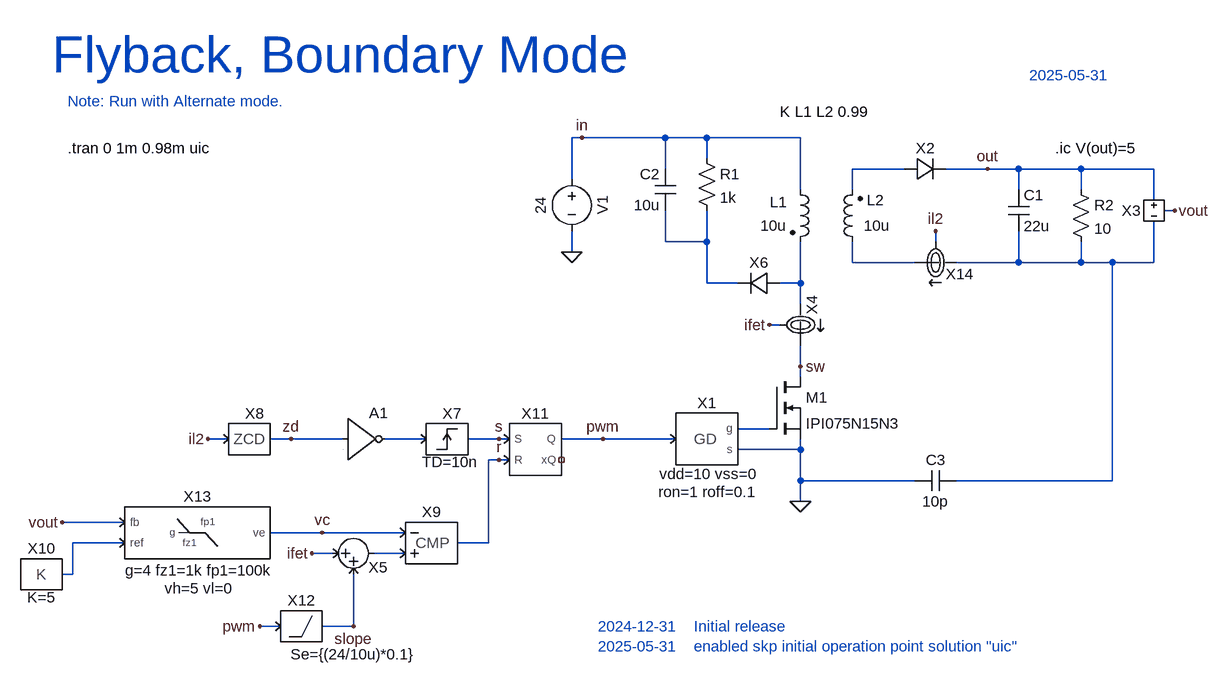
[diagram p0: schematic FLYBACK.asc]
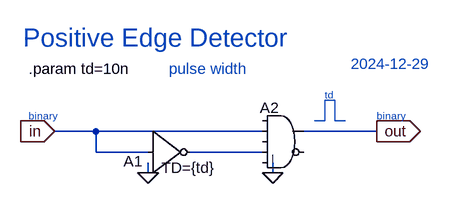
[diagram p1: sub-circuit posedge.asc]
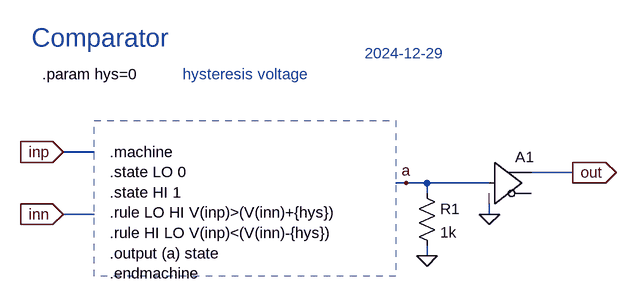
[diagram p2: sub-circuit cmp.asc]
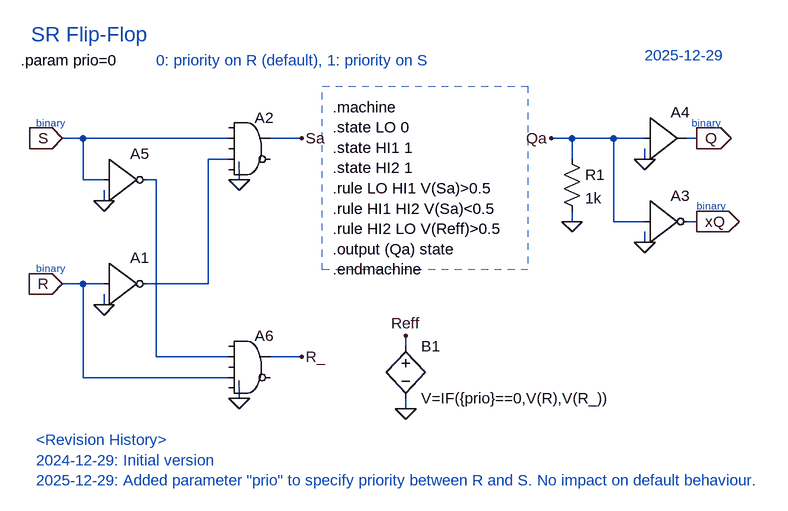
[diagram p3: sub-circuit srff.asc]
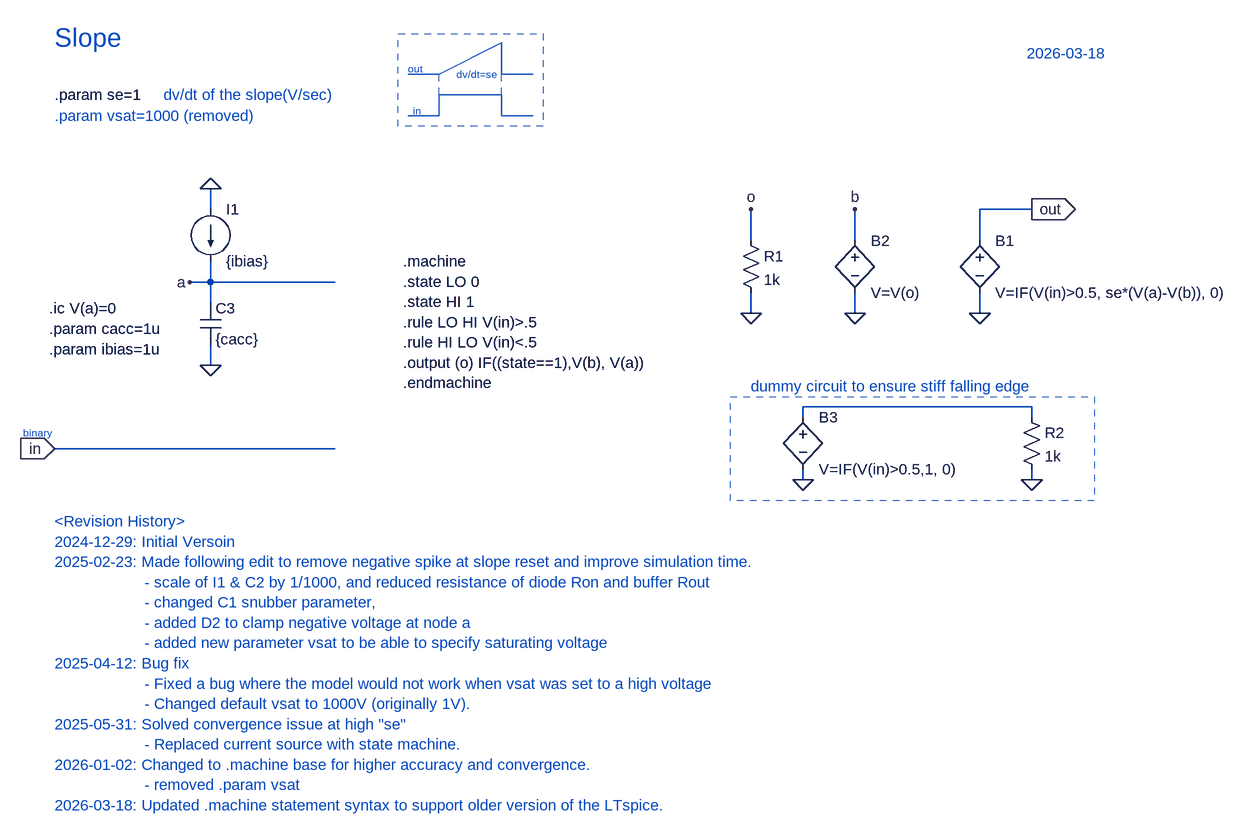
[diagram p4: sub-circuit slope.asc]
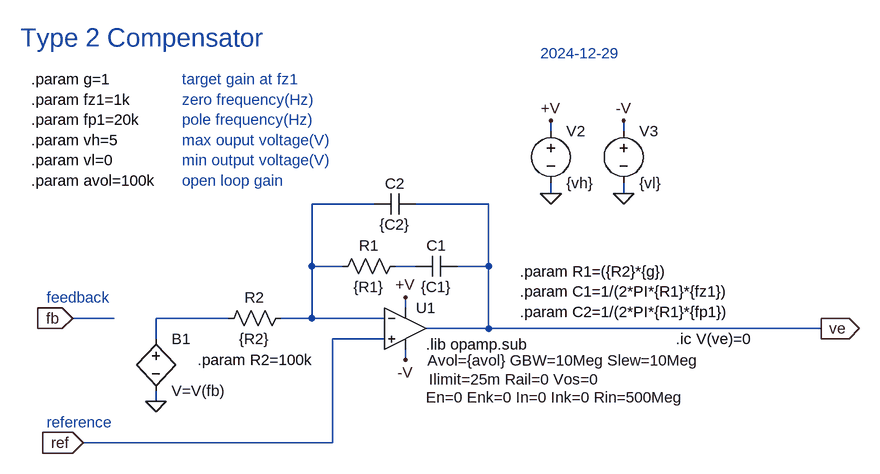
[diagram p5: sub-circuit type2.asc]
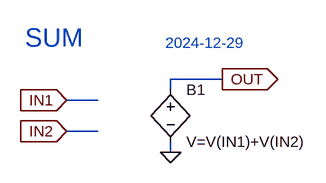
[diagram p6: sub-circuit sum.asc]
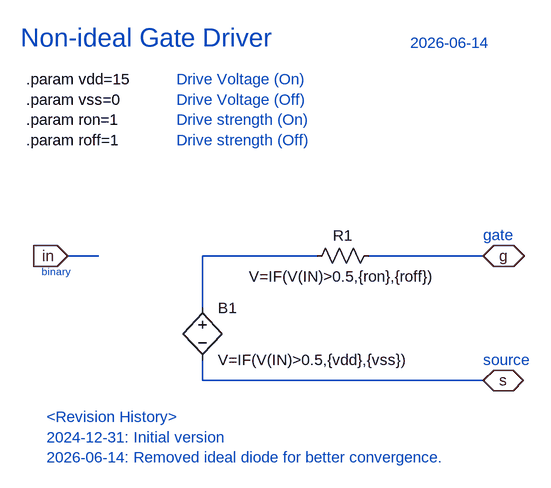
[diagram p7: sub-circuit gd.asc]
FLYBACK.asc, the LTspice schematic file:
Version 4.1
SHEET 1 1716 1312
WIRE 672 -176 656 -176
WIRE 800 -176 672 -176
WIRE 864 -176 800 -176
WIRE 1008 -176 864 -176
WIRE 864 -144 864 -176
WIRE 800 -128 800 -176
WIRE 1168 -128 1088 -128
WIRE 1296 -128 1232 -128
WIRE 1344 -128 1296 -128
WIRE 1440 -128 1344 -128
WIRE 1552 -128 1440 -128
WIRE 656 -112 656 -176
WIRE 1008 -96 1008 -176
WIRE 1088 -96 1088 -128
WIRE 1344 -96 1344 -128
WIRE 1440 -96 1440 -128
WIRE 1552 -80 1552 -128
WIRE 1584 -64 1568 -64
WIRE 800 -16 800 -64
WIRE 864 -16 864 -64
WIRE 864 -16 800 -16
WIRE 1216 -16 1216 -32
WIRE 656 0 656 -32
WIRE 1088 16 1088 -16
WIRE 1184 16 1088 16
WIRE 1344 16 1344 -32
WIRE 1344 16 1248 16
WIRE 1440 16 1440 -16
WIRE 1440 16 1344 16
WIRE 1488 16 1440 16
WIRE 1552 16 1552 -48
WIRE 1552 16 1488 16
WIRE 864 48 864 -16
WIRE 912 48 864 48
WIRE 1008 48 1008 -16
WIRE 1008 48 976 48
WIRE 1008 80 1008 48
WIRE 976 112 960 112
WIRE 1008 176 1008 144
WIRE 1008 192 1008 176
WIRE 960 272 912 272
WIRE 128 288 96 288
WIRE 224 288 192 288
WIRE 304 288 224 288
WIRE 432 288 368 288
WIRE 544 288 496 288
WIRE 560 288 544 288
WIRE 704 288 640 288
WIRE 816 288 704 288
WIRE 1008 304 1008 288
WIRE 1008 304 912 304
WIRE 544 320 528 320
WIRE 560 320 544 320
WIRE 1008 352 1008 304
WIRE 1184 352 1008 352
WIRE 1488 352 1488 16
WIRE 1488 352 1248 352
WIRE 1008 384 1008 352
WIRE -32 416 -128 416
WIRE 272 432 192 432
WIRE 400 432 272 432
WIRE -32 448 -112 448
WIRE 528 448 528 320
WIRE 528 448 480 448
WIRE 288 464 256 464
WIRE 400 464 352 464
WIRE -112 496 -112 448
WIRE -112 496 -128 496
WIRE 208 576 176 576
WIRE 320 576 320 496
WIRE 320 576 272 576
FLAG 656 0 0
FLAG 1008 176 sw
FLAG 272 432 vc
FLAG 704 288 pwm
FLAG 544 288 s
FLAG 544 320 r
FLAG 176 576 pwm
FLAG 320 576 slope
FLAG 672 -176 in
FLAG 1008 384 0
FLAG 960 112 ifet
FLAG 1296 -128 out
FLAG 1584 -64 vout
FLAG -128 416 vout
FLAG 256 464 ifet
FLAG 1216 -32 il2
FLAG 96 288 il2
FLAG 224 288 zd
SYMBOL voltage 656 -128 R0
WINDOW 0 32 56 VTop 2
WINDOW 3 -32 56 VBottom 2
WINDOW 123 0 0 Left 0
WINDOW 39 0 0 Left 0
SYMATTR InstName V1
SYMATTR Value 24
SYMBOL ind2 992 -112 R0
WINDOW 0 -31 35 Left 2
WINDOW 3 -46 71 Left 2
SYMATTR InstName L1
SYMATTR Value 10u
SYMATTR SpiceLine Rser=10m
SYMATTR Type ind
SYMBOL IMON 1008 112 R90
SYMATTR InstName X4
SYMBOL POSEDGE 464 288 R0
WINDOW 39 5 51 Bottom 2
SYMATTR SpiceLine TD=10n
SYMATTR InstName X7
SYMBOL CMP 448 448 R0
SYMATTR InstName X9
SYMBOL SRFF 592 304 R0
SYMATTR InstName X11
SYMBOL SLOPE 240 576 R0
WINDOW 39 80 59 Bottom 2
SYMATTR SpiceLine Se={(24/10u)*0.1}
SYMATTR InstName X12
SYMBOL TYPE2 80 432 R0
WINDOW 0 0 -56 Center 2
WINDOW 39 2 58 Center 2
WINDOW 40 2 86 Center 2
SYMATTR InstName X13
SYMATTR SpiceLine g=4 fz1=1k fp1=100k
SYMBOL CONST -160 496 R0
WINDOW 39 0 51 Bottom 2
SYMATTR SpiceLine K=5
SYMATTR InstName X10
SYMBOL SUM 320 464 R0
WINDOW 0 38 37 Bottom 2
SYMATTR InstName X5
SYMBOL PowerSim\\GD 864 288 R0
WINDOW 39 2 69 Bottom 2
WINDOW 40 2 97 Bottom 2
SYMATTR SpiceLine vdd=10 vss=0
SYMATTR SpiceLine2 ron=1 roff=0.1
SYMATTR InstName X1
SYMBOL nmos 960 192 R0
SYMATTR InstName M1
SYMATTR Value IPI075N15N3
SYMBOL res 848 -160 R0
SYMATTR InstName R1
SYMATTR Value 1k
SYMBOL ind2 1104 0 R180
WINDOW 0 -33 80 Left 2
WINDOW 3 -42 41 Left 2
SYMATTR InstName L2
SYMATTR Value 10u
SYMATTR SpiceLine Rser=10m
SYMATTR Type ind
SYMBOL PowerSim\\iD 1200 -128 R270
WINDOW 0 16 0 VTop 2
SYMATTR InstName X2
SYMBOL cap 1328 -96 R0
SYMATTR InstName C1
SYMATTR Value 22u
SYMATTR SpiceLine Rser=1m
SYMBOL res 1424 -112 R0
SYMATTR InstName R2
SYMATTR Value 10
SYMBOL PowerSim\\VMON 1552 -64 R0
SYMATTR InstName X3
SYMBOL cap 816 -128 M0
SYMATTR InstName C2
SYMATTR Value 10u
SYMATTR SpiceLine Rser=1m
SYMBOL IMON 1216 16 R180
SYMATTR InstName X14
SYMBOL PowerSim\\ZCD 160 288 R0
SYMATTR InstName X8
SYMBOL Digital\\inv 304 224 R0
SYMATTR InstName A1
SYMBOL cap 1248 336 R90
WINDOW 0 0 32 VBottom 2
WINDOW 3 32 32 VTop 2
SYMATTR InstName C3
SYMATTR Value 10p
SYMBOL PowerSim\\iD 944 48 R90
WINDOW 0 -16 0 VBottom 2
SYMATTR InstName X6
TEXT -120 -160 Left 2 !.tran 0 1m 0.98m uic
TEXT -144 -304 Left 6 ;Flyback, Boundary Mode
TEXT 1360 -272 Left 2 ;2025-05-31
TEXT 976 -216 Left 2 !K L1 L2 0.99
TEXT 1400 -160 Left 2 !.ic V(out)=5
TEXT -120 -232 Left 2 ;Note: Run with Alternate mode.
TEXT 696 576 Left 2 ;2024-12-31    Initial release\n2025-05-31    enabled skp initial operation point solution "uic"

posedge.asc, the sub-circuit schematic file:
Version 4
SHEET 1 880 680
WIRE 192 160 128 160
WIRE 448 160 192 160
WIRE 624 160 512 160
WIRE 192 192 192 160
WIRE 272 192 192 192
WIRE 448 192 336 192
WIRE 272 224 272 208
WIRE 464 224 464 208
FLAG 128 160 in
IOPIN 128 160 In
FLAG 464 224 0
FLAG 624 160 out
IOPIN 624 160 Out
FLAG 272 224 0
SYMBOL Digital\\and 480 112 R0
WINDOW 0 -36 12 Left 2
SYMATTR InstName A2
SYMBOL Digital\\inv 272 128 R0
WINDOW 3 21 88 Left 2
WINDOW 0 -38 78 Left 2
SYMATTR Value TD={td}
SYMATTR InstName A1
TEXT 88 64 Left 2 !.param td=10n
TEXT 80 16 Left 4 ;Positive Edge Detector
TEXT 88 136 Left 1 ;binary
TEXT 624 136 Left 1 ;binary
TEXT 544 104 Left 1 ;td
TEXT 304 64 Left 2 ;pulse width
TEXT 584 56 Left 2 ;2024-12-29
LINE Normal 544 144 528 144
LINE Normal 544 144 544 112
LINE Normal 560 144 560 112
LINE Normal 576 144 560 144
LINE Normal 544 112 560 112

cmp.asc, the sub-circuit schematic file:
Version 4
SHEET 1 1276 680
WIRE 352 96 304 96
WIRE 1088 128 1024 128
WIRE 832 144 816 144
WIRE 864 144 832 144
WIRE 960 144 864 144
WIRE 864 160 864 144
WIRE 352 192 304 192
WIRE 960 192 960 176
WIRE 864 256 864 240
FLAG 304 96 inp
IOPIN 304 96 In
FLAG 304 192 inn
IOPIN 304 192 In
FLAG 1088 128 out
IOPIN 1088 128 Out
FLAG 864 256 0
FLAG 832 144 a
FLAG 960 192 0
SYMBOL res 848 144 R0
SYMATTR InstName R1
SYMATTR Value 1k
SYMBOL Digital\\buf 960 80 R0
SYMATTR InstName A1
TEXT 376 96 Left 2 !.machine\n.state LO 0\n.state HI 1\n.rule LO HI V(inp)>(V(inn)+{hys})\n.rule HI LO V(inp)<(V(inn)-{hys})\n.output (a) state\n.endmachine
TEXT 272 -24 Left 2 !.param hys=0
TEXT 256 -80 Left 4 ;Comparator
TEXT 488 -24 Left 2 ;hysteresis voltage
TEXT 768 -56 Left 2 ;2024-12-29
RECTANGLE Normal 816 288 352 48 2

srff.asc, the sub-circuit schematic file:
Version 4.1
SHEET 1 928 680
WIRE -272 -496 -304 -496
WIRE -48 -496 -272 -496
WIRE 64 -496 16 -496
WIRE 480 -496 448 -496
WIRE 544 -496 480 -496
WIRE 592 -496 544 -496
WIRE 672 -496 656 -496
WIRE -48 -464 -80 -464
WIRE 480 -464 480 -496
WIRE 592 -464 592 -480
WIRE -272 -432 -272 -496
WIRE -240 -432 -272 -432
WIRE -160 -432 -176 -432
WIRE -32 -432 -32 -448
WIRE -240 -400 -240 -416
WIRE 480 -368 480 -384
WIRE 544 -368 544 -496
WIRE 592 -368 544 -368
WIRE 672 -368 656 -368
WIRE 592 -336 592 -352
WIRE -272 -272 -304 -272
WIRE -240 -272 -272 -272
WIRE -80 -272 -80 -464
WIRE -80 -272 -176 -272
WIRE -240 -240 -240 -256
WIRE 224 -176 224 -192
WIRE -160 -160 -160 -432
WIRE -48 -160 -160 -160
WIRE 64 -160 16 -160
WIRE -272 -128 -272 -272
WIRE -48 -128 -272 -128
WIRE -32 -96 -32 -112
WIRE 224 -80 224 -96
FLAG -304 -496 S
IOPIN -304 -496 In
FLAG -304 -272 R
IOPIN -304 -272 In
FLAG -240 -240 0
FLAG -32 -432 0
FLAG 64 -496 Sa
FLAG 592 -336 0
FLAG 672 -496 Q
IOPIN 672 -496 Out
FLAG 672 -368 xQ
IOPIN 672 -368 Out
FLAG 592 -464 0
FLAG 448 -496 Qa
FLAG 480 -368 0
FLAG 224 -80 0
FLAG 224 -192 Reff
FLAG -240 -400 0
FLAG -32 -96 0
FLAG 64 -160 R_
SYMBOL Digital\\inv -240 -336 R0
SYMATTR InstName A1
SYMBOL Digital\\and -16 -544 R0
SYMATTR InstName A2
SYMBOL Digital\\inv 592 -432 R0
SYMATTR InstName A3
SYMBOL Digital\\buf1 592 -560 R0
SYMATTR InstName A4
SYMBOL res 464 -480 R0
SYMATTR InstName R1
SYMATTR Value 1k
SYMBOL bv 224 -192 R0
SYMATTR InstName B1
SYMATTR Value V=IF({prio}==0,V(R),V(R_))
SYMBOL Digital\\inv -240 -496 R0
SYMATTR InstName A5
SYMBOL Digital\\and -16 -208 R0
SYMATTR InstName A6
TEXT 112 -544 Left 2 !.machine\n.state LO 0\n.state HI1 1\n.state HI2 1\n.rule LO HI1 V(Sa)>0.5\n.rule HI1 HI2 V(Sa)<0.5\n.rule HI2 LO V(Reff)>0.5\n.output (Qa) state\n.endmachine
TEXT -352 -656 Left 3 ;SR Flip-Flop
TEXT -344 -520 Left 1 ;binary
TEXT -344 -296 Left 1 ;binary
TEXT 664 -520 Left 1 ;binary
TEXT 672 -392 Left 1 ;binary
TEXT 592 -624 Left 2 ;2025-12-29
TEXT -368 -616 Left 2 !.param prio=0
TEXT -160 -616 Left 2 ;0: priority on R (default), 1: priority on S
TEXT -344 -32 Left 2 ;<Revision History>\n2024-12-29: Initial version\n2025-12-29: Added parameter "prio" to specify priority between R and S. No impact on default behaviour.
RECTANGLE Normal 412 -294 96 -576 2

slope.asc, the sub-circuit schematic file:
Version 4.1
SHEET 1 2080 1228
WIRE -64 288 -64 256
WIRE 1200 288 1120 288
WIRE 768 336 768 288
WIRE 928 336 928 288
WIRE 1120 336 1120 288
WIRE -64 400 -64 368
WIRE -64 400 -96 400
WIRE 128 400 -64 400
WIRE -64 432 -64 400
WIRE 768 448 768 416
WIRE 928 448 928 416
WIRE 1120 448 1120 416
WIRE -64 528 -64 496
WIRE 1200 592 848 592
WIRE 848 608 848 592
WIRE 1200 608 1200 592
WIRE 128 656 -304 656
WIRE 848 704 848 688
WIRE 1200 704 1200 688
FLAG -304 656 in
IOPIN -304 656 In
FLAG -64 256 0
FLAG -64 528 0
FLAG 1200 288 out
IOPIN 1200 288 Out
FLAG -96 400 a
FLAG 1120 448 0
FLAG 768 448 0
FLAG 768 288 o
FLAG 928 448 0
FLAG 928 288 b
FLAG 1200 704 0
FLAG 848 704 0
SYMBOL current -64 288 R0
SYMATTR InstName I1
SYMATTR Value {ibias}
SYMBOL cap -80 432 R0
SYMATTR InstName C3
SYMATTR Value {cacc}
SYMBOL bv 1120 320 R0
SYMATTR InstName B1
SYMATTR Value V=IF(V(in)>0.5, se*(V(a)-V(b)), 0)
SYMBOL res 752 320 R0
SYMATTR InstName R1
SYMATTR Value 1k
SYMBOL bv 928 320 R0
SYMATTR InstName B2
SYMATTR Value V=V(o)
SYMBOL bv 848 592 R0
SYMATTR InstName B3
SYMATTR Value V=IF(V(in)>0.5,1, 0)
SYMBOL res 1184 592 R0
SYMATTR InstName R2
SYMATTR Value 1k
TEXT -304 112 Left 2 !.param se=1
TEXT -304 24 Left 4 ;Slope
TEXT -352 632 Left 1 ;binary
TEXT -136 112 Left 2 ;dv/dt of the slope(V/sec)
TEXT 248 136 Left 1 ;in
TEXT 240 72 Left 1 ;out
TEXT 376 80 Right 1 ;dv/dt=se
TEXT 1192 48 Left 2 ;2026-03-18
TEXT -304 768 Left 2 ;<Revision History>\n2024-12-29: Initial Versoin\n2025-02-23: Made following edit to remove negative spike at slope reset and improve simulation time.\n                    - scale of I1 & C2 by 1/1000, and reduced resistance of diode Ron and buffer Rout\n                    - changed C1 snubber parameter, \n                    - added D2 to clamp negative voltage at node a \n                    - added new parameter vsat to be able to specify saturating voltage\n2025-04-12: Bug fix \n                    - Fixed a bug where the model would not work when vsat was set to a high voltage \n                    - Changed default vsat to 1000V (originally 1V).\n2025-05-31: Solved convergence issue at high "se" \n                    - Replaced current source with state machine.\n2026-01-02: Changed to .machine base for higher accuracy and convergence.\n                    - removed .param vsat\n2026-03-18: Updated .machine statement syntax to support older version of the LTspice.
TEXT -304 144 Left 2 ;.param vsat=1000 (removed)
TEXT -312 472 Left 2 !.param cacc=1u\n.param ibias=1u
TEXT -312 440 Left 2 !.ic V(a)=0
TEXT 232 368 Left 2 !.machine\n.state LO 0\n.state HI 1\n.rule LO HI V(in)>.5\n.rule HI LO V(in)<.5\n.output (o) IF((state==1),V(b), V(a))\n.endmachine
TEXT 768 560 Left 2 ;dummy circuit to ensure stiff falling edge
LINE Normal 288 144 240 144
LINE Normal 288 144 288 112
LINE Normal 384 112 288 112
LINE Normal 384 144 384 112
LINE Normal 432 144 384 144
LINE Normal 288 80 240 80
LINE Normal 288 80 384 32
LINE Normal 384 80 384 32
LINE Normal 432 80 384 80
LINE Normal 288 112 288 80 1
LINE Normal 384 112 384 80 1
RECTANGLE Normal 448 160 225 18 2
RECTANGLE Normal 1296 736 736 576 2

type2.asc, the sub-circuit schematic file:
Version 4
SHEET 1 1008 680
WIRE 464 -144 464 -160
WIRE 576 -144 576 -160
WIRE 464 -48 464 -64
WIRE 576 -48 576 -64
WIRE 192 -32 96 -32
WIRE 368 -32 256 -32
WIRE 96 64 96 -32
WIRE 144 64 96 64
WIRE 256 64 224 64
WIRE 368 64 368 -32
WIRE 368 64 320 64
WIRE 240 128 240 112
WIRE -208 144 -272 144
WIRE -32 144 -144 144
WIRE 96 144 96 64
WIRE 96 144 48 144
WIRE 208 144 96 144
WIRE 368 160 368 64
WIRE 368 160 272 160
WIRE 880 160 368 160
WIRE -144 176 -144 144
WIRE 208 176 128 176
WIRE 240 208 240 192
WIRE -144 272 -144 256
WIRE 128 336 128 176
WIRE 128 336 -256 336
FLAG -272 144 fb
IOPIN -272 144 In
FLAG -256 336 ref
IOPIN -256 336 In
FLAG -144 272 0
FLAG 880 160 ve
IOPIN 880 160 Out
FLAG 576 -48 0
FLAG 464 -48 0
FLAG 464 -160 +V
FLAG 576 -160 -V
FLAG 240 112 +V
FLAG 240 208 -V
SYMBOL res 240 48 R90
WINDOW 0 0 56 VBottom 2
WINDOW 3 32 56 VTop 2
SYMATTR InstName R1
SYMATTR Value {R1}
SYMBOL cap 320 48 R90
WINDOW 0 0 32 VBottom 2
WINDOW 3 32 32 VTop 2
SYMATTR InstName C1
SYMATTR Value {C1}
SYMBOL cap 256 -48 R90
WINDOW 0 0 32 VBottom 2
WINDOW 3 32 32 VTop 2
SYMATTR InstName C2
SYMATTR Value {C2}
SYMBOL bv -144 160 R0
SYMATTR InstName B1
SYMATTR Value V=V(fb)
SYMBOL res 64 128 R90
WINDOW 0 0 56 VBottom 2
WINDOW 3 32 56 VTop 2
SYMATTR InstName R2
SYMATTR Value {R2}
SYMBOL UniversalOpAmp2 240 160 R0
WINDOW 123 34 49 Left 2
WINDOW 39 36 78 Left 2
WINDOW 40 32 106 Left 2
SYMATTR Value2 Avol={avol} GBW=10Meg Slew=10Meg
SYMATTR InstName U1
SYMBOL voltage 464 -160 R0
SYMATTR InstName V2
SYMATTR Value {vh}
SYMBOL voltage 576 -160 R0
SYMATTR InstName V3
SYMATTR Value {vl}
TEXT 272 184 Left 2 !.lib opamp.sub
TEXT -336 -224 Left 2 !.param g=1\n.param fz1=1k\n.param fp1=20k\n.param vh=5\n.param vl=0\n.param avol=100k
TEXT 416 72 Left 2 !.param R1=({R2}*{g})\n.param C1=1/(2*PI*{R1}*{fz1})\n.param C2=1/(2*PI*{R1}*{fp1})
TEXT -352 -288 Left 4 ;Type 2 Compensator
TEXT -80 208 Left 2 !.param R2=100k
TEXT -104 -224 Left 2 ;target gain at fz1\nzero frequency(Hz)\npole frequency(Hz)\nmax ouput voltage(V)\nmin output voltage(V)\nopen loop gain
TEXT -312 112 Left 2 ;feedback
TEXT -312 304 Left 2 ;reference
TEXT 656 176 Left 2 !.ic V(ve)=0
TEXT 448 -264 Left 2 ;2024-12-29

sum.asc, the sub-circuit schematic file:
Version 4
SHEET 1 880 680
WIRE 288 96 208 96
WIRE 208 112 208 96
WIRE 96 128 48 128
WIRE 96 176 48 176
WIRE 208 208 208 192
FLAG 48 128 IN1
IOPIN 48 128 In
FLAG 48 176 IN2
IOPIN 48 176 In
FLAG 208 208 0
FLAG 288 96 OUT
IOPIN 288 96 Out
SYMBOL bv 208 96 R0
SYMATTR InstName B1
SYMATTR Value V=V(IN1)+V(IN2)
TEXT -16 32 Left 4 ;SUM
TEXT 200 40 Left 2 ;2024-12-29

gd.asc, the sub-circuit schematic file:
Version 4.1
SHEET 1 1232 680
WIRE 64 48 16 48
WIRE 400 48 224 48
WIRE 656 48 480 48
WIRE 224 128 224 48
WIRE 224 240 224 208
WIRE 656 240 224 240
FLAG 16 48 in
IOPIN 16 48 In
FLAG 656 48 g
IOPIN 656 48 BiDir
FLAG 656 240 s
IOPIN 656 240 BiDir
SYMBOL bv 224 112 R0
SYMATTR InstName B1
SYMATTR Value V=IF(V(IN)>0.5,{vdd},{vss})
SYMBOL res 496 32 R90
WINDOW 0 0 56 VBottom 2
WINDOW 3 32 56 VTop 2
SYMATTR InstName R1
SYMATTR Value V=IF(V(IN)>0.5,{ron},{roff})
TEXT -48 -224 Left 2 !.param vdd=15\n.param vss=0\n.param ron=1\n.param roff=1
TEXT -56 -288 Left 4 ;Non-ideal Gate Driver
TEXT 184 -224 Left 2 ;Drive Voltage (On)\nDrive Voltage (Off)\nDrive strength (On)\nDrive strength (Off)
TEXT -24 72 Left 1 ;binary
TEXT 656 16 Left 2 ;gate
TEXT 656 208 Left 2 ;source
TEXT 544 -280 Left 2 ;2026-06-14
TEXT -16 296 Left 2 ;<Revision History>\n2024-12-31: Initial version\n2026-06-14: Removed ideal diode for better convergence.

vmon.asc, the sub-circuit schematic file:
Version 4
SHEET 1 880 680
WIRE 176 -32 80 -32
WIRE -112 0 -112 -32
WIRE 80 0 80 -32
WIRE -112 96 -112 80
WIRE 80 112 80 80
FLAG -112 -32 p
IOPIN -112 -32 BiDir
FLAG -112 96 n
IOPIN -112 96 BiDir
FLAG 176 -32 out
IOPIN 176 -32 Out
FLAG 80 112 0
SYMBOL bv 80 -16 R0
SYMATTR InstName B1
SYMATTR Value V=V(p)-V(n)
SYMBOL current -112 0 R0
WINDOW 123 0 0 Left 0
WINDOW 39 0 0 Left 0
SYMATTR InstName I1
SYMATTR Value 0
TEXT -144 -160 Left 4 ;Voltage Monitor
TEXT -88 -56 Left 2 ;positive
TEXT -88 120 Left 2 ;negative
TEXT 192 -112 Left 2 ;2024-12-29

zcd.asc, the sub-circuit schematic file:
Version 4.1
SHEET 1 952 680
WIRE -32 384 -80 384
WIRE 752 384 640 384
WIRE 448 400 432 400
WIRE 480 400 448 400
WIRE 576 400 480 400
WIRE 480 416 480 400
WIRE 576 448 576 432
WIRE 480 512 480 496
FLAG -80 384 in
IOPIN -80 384 In
FLAG 752 384 zcd
IOPIN 752 384 Out
FLAG 480 512 0
FLAG 448 400 a
FLAG 576 448 0
SYMBOL res 464 400 R0
SYMATTR InstName R1
SYMATTR Value 1k
SYMBOL Digital\\buf 576 336 R0
SYMATTR InstName A1
TEXT 16 -8 Left 4 ;Zero Cross Detector
TEXT 752 360 Left 1 ;binary
TEXT 752 408 Left 1 ;1: input positive\n0: input negative
TEXT 720 8 Left 2 ;2025-07-21
TEXT -8 352 Left 2 !.machine\n.state LO 0\n.state HI 1\n.rule LO HI V(in)>{hys}\n.rule HI LO V(in)<-{hys}\n.output (a) state\n.endmachine
TEXT 24 40 Left 2 !.param hys=0
TEXT 240 40 Left 2 ;hysteresis voltage
TEXT -80 600 Left 2 ;<Revision History>\n2024-12-29: Initial version\n2025-07-21: Changed to .machine and added hysteresis.
RECTANGLE Normal 432 544 -32 304 2

The netlist it stands for:
* FLYBACK.asc
V1 in 0 24
L1 in N005 10u Rser=10m
X§X4 sw ifet N005 IMON rsns=10u  ; pins n out p
X§X7 N007 s posedge params: TD=10n
X§X9 vc N009 r cmp params: hys=0
X§X11 r s pwm NC_01 srff params: prio=0
X§X12 pwm slope slope params: Se={(24/10u)*0.1}
X§X13 vout N008 vc type2 params: avol=100k g=4 fz1=1k fp1=100k vh=5 vl=0
X§X10 N008 CONST K=5  ; pins K
X§X5 ifet slope N009 sum
X§X1 pwm N006 0 gd params: vdd=10 vss=0 ron=1 roff=0.1
M1 sw N006 0 0 IPI075N15N3
R1 in N002 1k
L2 N003 N001 10u Rser=10m
X§X2 N001 out iD params: von=1n ron=10m esl=1f rsnb=1k csnb=10p  ; pins AN CA
C1 out N004 22u Rser=1m
R2 out N004 10
X§X3 N004 vout out vmon
C2 in N002 10u Rser=1m
X§X14 N003 il2 N004 IMON rsns=10u  ; pins n out p
X§X8 il2 zd zcd params: hys=0
A1 zd 0 0 0 0 N007 0 0 BUF
C3 N004 0 10p
X§X6 N005 N002 iD params: von=1n ron=10m esl=1f rsnb=1k csnb=10p  ; pins AN CA

* block symbol definitions
.subckt posedge in out
A2 0 in 0 N001 0 0 out 0 AND
A1 in 0 0 0 0 N001 0 0 BUF TD={td}
.param td=10n
* Positive Edge Detector
* binary
* binary
* td
* pulse width
* 2024-12-29
.ends posedge

.subckt cmp inn inp out
R1 a 0 1k
A1 a 0 0 0 0 0 out 0 BUF
.machine
.state LO 0
.state HI 1
.rule LO HI V(inp)>(V(inn)+{hys})
.rule HI LO V(inp)<(V(inn)-{hys})
.output (a) state
.endmachine
.param hys=0
* Comparator
* hysteresis voltage
* 2024-12-29
.ends cmp

.subckt srff R S Q xQ
A1 R 0 0 0 0 N001 0 0 BUF
A2 0 S 0 N001 0 0 Sa 0 AND
A3 Qa 0 0 0 0 xQ 0 0 BUF
A4 Qa 0 0 0 0 0 Q 0 BUF
R1 Qa 0 1k
B1 Reff 0 V=IF({prio}==0,V(R),V(R_))
A5 S 0 0 0 0 N002 0 0 BUF
A6 0 N002 0 R 0 0 R_ 0 AND
.machine
.state LO 0
.state HI1 1
.state HI2 1
.rule LO HI1 V(Sa)>0.5
.rule HI1 HI2 V(Sa)<0.5
.rule HI2 LO V(Reff)>0.5
.output (Qa) state
.endmachine
* SR Flip-Flop
* binary
* binary
* binary
* binary
* 2025-12-29
.param prio=0
* 0: priority on R (default), 1: priority on S
* <Revision History>
* 2024-12-29: Initial version
* 2025-12-29: Added parameter "prio" to specify priority between R and S. No impact on default behaviour.
.ends srff

.subckt slope in out
I1 0 a {ibias}
C3 a 0 {cacc}
B1 out 0 V=IF(V(in)>0.5, se*(V(a)-V(b)), 0)
R1 o 0 1k
B2 b 0 V=V(o)
B3 N001 0 V=IF(V(in)>0.5,1, 0)
R2 N001 0 1k
.param se=1
* Slope
* binary
* dv/dt of the slope(V/sec)
* in
* out
* dv/dt=se
* 2026-03-18
* <Revision History>
* 2024-12-29: Initial Versoin
* 2025-02-23: Made following edit to remove negative spike at slope reset and improve simulation time.
*                     - scale of I1 & C2 by 1/1000, and reduced resistance of diode Ron and buffer Rout
*                     - changed C1 snubber parameter,
*                     - added D2 to clamp negative voltage at node a
*                     - added new parameter vsat to be able to specify saturating voltage
* 2025-04-12: Bug fix
*                     - Fixed a bug where the model would not work when vsat was set to a high voltage
*                     - Changed default vsat to 1000V (originally 1V).
* 2025-05-31: Solved convergence issue at high "se"
*                     - Replaced current source with state machine.
* 2026-01-02: Changed to .machine base for higher accuracy and convergence.
*                     - removed .param vsat
* 2026-03-18: Updated .machine statement syntax to support older version of the LTspice.
* .param vsat=1000 (removed)
.param cacc=1u
.param ibias=1u
.ic V(a)=0
.machine
.state LO 0
.state HI 1
.rule LO HI V(in)>.5
.rule HI LO V(in)<.5
.output (o) IF((state==1),V(b), V(a))
.endmachine
* dummy circuit to ensure stiff falling edge
.ends slope

.subckt type2 fb ref ve
R1 N002 N001 {R1}
C1 ve N002 {C1}
C2 ve N001 {C2}
B1 N003 0 V=V(fb)
R2 N001 N003 {R2}
XU1 ref N001 +V -V ve level2 Avol={avol} GBW=10Meg Slew=10Meg Ilimit=25m Rail=0 Vos=0 En=0 Enk=0 In=0 Ink=0 Rin=500Meg  ; pins In+ In- V+ V- OUT
V2 +V 0 {vh}
V3 -V 0 {vl}
.lib opamp.sub
.param g=1
.param fz1=1k
.param fp1=20k
.param vh=5
.param vl=0
.param avol=100k
.param R1=({R2}*{g})
.param C1=1/(2*PI*{R1}*{fz1})
.param C2=1/(2*PI*{R1}*{fp1})
* Type 2 Compensator
.param R2=100k
* target gain at fz1
* zero frequency(Hz)
* pole frequency(Hz)
* max ouput voltage(V)
* min output voltage(V)
* open loop gain
* feedback
* reference
.ic V(ve)=0
* 2024-12-29
.ends type2

.subckt sum in1 in2 out
B1 OUT 0 V=V(IN1)+V(IN2)
* SUM
* 2024-12-29
.ends sum

.subckt gd in g s
B1 N001 s V=IF(V(IN)>0.5,{vdd},{vss})
R1 g N001 V=IF(V(IN)>0.5,{ron},{roff})
.param vdd=15
.param vss=0
.param ron=1
.param roff=1
* Non-ideal Gate Driver
* Drive Voltage (On)
* Drive Voltage (Off)
* Drive strength (On)
* Drive strength (Off)
* binary
* gate
* source
* 2026-06-14
* <Revision History>
* 2024-12-31: Initial version
* 2026-06-14: Removed ideal diode for better convergence.
.ends gd

.subckt vmon n out p
B1 out 0 V=V(p)-V(n)
I1 p n 0
* Voltage Monitor
* positive
* negative
* 2024-12-29
.ends vmon

.subckt zcd in zcd
R1 a 0 1k
A1 a 0 0 0 0 0 zcd 0 BUF
* Zero Cross Detector
* binary
* 1: input positive
* 0: input negative
* 2025-07-21
.machine
.state LO 0
.state HI 1
.rule LO HI V(in)>{hys}
.rule HI LO V(in)<-{hys}
.output (a) state
.endmachine
.param hys=0
* hysteresis voltage
* <Revision History>
* 2024-12-29: Initial version
* 2025-07-21: Changed to .machine and added hysteresis.
.ends zcd

.model NMOS NMOS
.model PMOS PMOS
.lib standard.mos
.tran 0 1m 0.98m uic
* Flyback, Boundary Mode
* 2025-05-31
K L1 L2 0.99
.ic V(out)=5
* Note: Run with Alternate mode.
* 2024-12-31    Initial release
* 2025-05-31    enabled skp initial operation point solution "uic"
.lib UniversalOpAmp2.lib
.backanno
.end